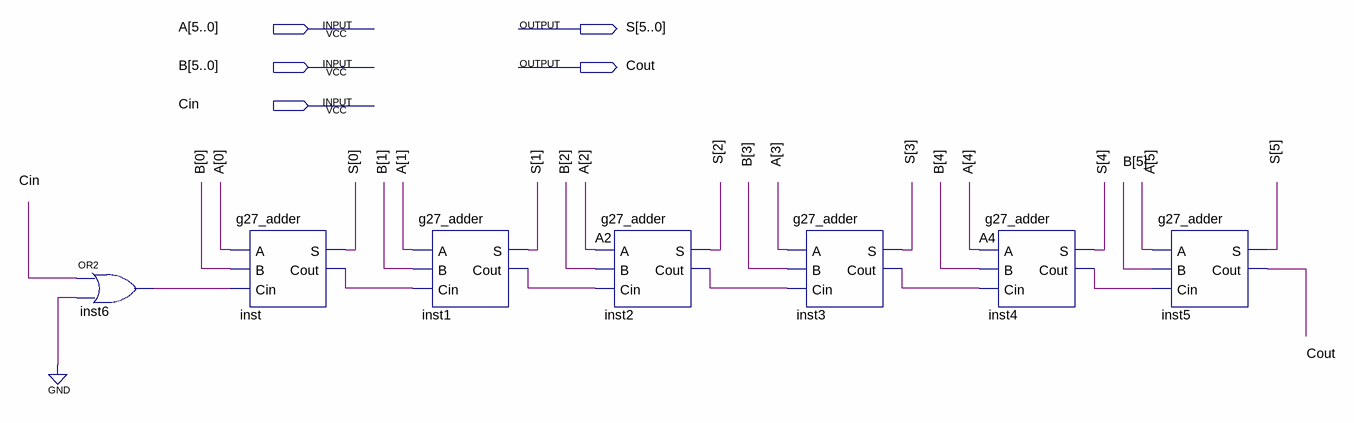
[diagram p0: schematic sheet]
// Quartus schematic g27_6bit_adder.bdf as structural Verilog: 7 symbols, 5 pins
module g27_6bit_adder (
  input  [5:0] A,
  input  [5:0] B,
  input  Cin,
  output [5:0] S,
  output Cout
);

  wire inst1_cout, inst2_cout, inst3_cout, inst4_cout, inst6_out, inst_cout;

  or inst6 (inst6_out, Cin, 1'b0);
  g27_adder inst (.A(A[0]), .B(B[0]), .Cin(inst6_out), .S(S[0]), .Cout(inst_cout));
  g27_adder inst1 (.A(A[1]), .B(B[1]), .Cin(inst_cout), .S(S[1]), .Cout(inst1_cout));
  g27_adder inst2 (.A(A[2]), .B(B[2]), .Cin(inst1_cout), .S(S[2]), .Cout(inst2_cout));
  g27_adder inst3 (.A(A[3]), .B(B[3]), .Cin(inst2_cout), .S(S[3]), .Cout(inst3_cout));
  g27_adder inst4 (.A(A[4]), .B(B[4]), .Cin(inst3_cout), .S(S[4]), .Cout(inst4_cout));
  g27_adder inst5 (.A(A[5]), .B(B[5]), .Cin(inst4_cout), .S(S[5]), .Cout(Cout));
endmodule
